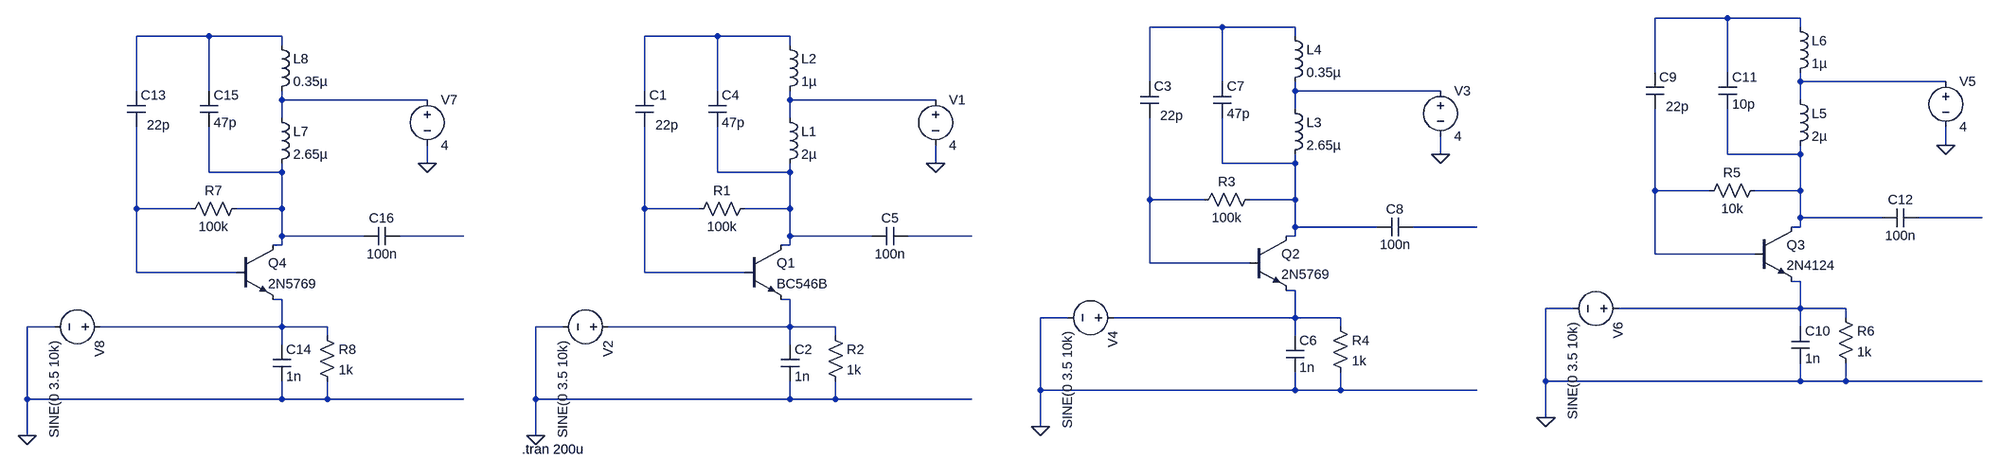
[diagram p0: schematic BJT_AM_Sender.asc]
BJT_AM_Sender.asc, the LTspice schematic file:
Version 4
SHEET 1 2468 680
WIRE 2016 -256 1888 -256
WIRE 2144 -256 2016 -256
WIRE 1120 -240 992 -240
WIRE 1248 -240 1120 -240
WIRE 2144 -240 2144 -256
WIRE -880 -224 -1008 -224
WIRE -752 -224 -880 -224
WIRE 48 -224 -80 -224
WIRE 176 -224 48 -224
WIRE 1248 -224 1248 -240
WIRE -752 -208 -752 -224
WIRE 176 -208 176 -224
WIRE 1888 -160 1888 -256
WIRE 2016 -160 2016 -256
WIRE 992 -144 992 -240
WIRE 1120 -144 1120 -240
WIRE 2144 -144 2144 -160
WIRE 2400 -144 2144 -144
WIRE -1008 -128 -1008 -224
WIRE -880 -128 -880 -224
WIRE -80 -128 -80 -224
WIRE 48 -128 48 -224
WIRE 1248 -128 1248 -144
WIRE 1504 -128 1248 -128
WIRE -752 -112 -752 -128
WIRE -496 -112 -752 -112
WIRE 176 -112 176 -128
WIRE 432 -112 176 -112
WIRE 2144 -112 2144 -144
WIRE 1248 -96 1248 -128
WIRE -752 -80 -752 -112
WIRE 176 -80 176 -112
WIRE 2400 -32 2400 -64
WIRE 1504 -16 1504 -48
WIRE 2016 -16 2016 -96
WIRE 2144 -16 2144 -32
WIRE 2144 -16 2016 -16
WIRE -496 0 -496 -32
WIRE 432 0 432 -32
WIRE 1120 0 1120 -80
WIRE 1248 0 1248 -16
WIRE 1248 0 1120 0
WIRE -880 16 -880 -64
WIRE -752 16 -752 0
WIRE -752 16 -880 16
WIRE 48 16 48 -64
WIRE 176 16 176 0
WIRE 176 16 48 16
WIRE 1888 48 1888 -96
WIRE 1984 48 1888 48
WIRE 2144 48 2144 -16
WIRE 2144 48 2064 48
WIRE 992 64 992 -80
WIRE 1088 64 992 64
WIRE 1248 64 1248 0
WIRE 1248 64 1168 64
WIRE -1008 80 -1008 -64
WIRE -912 80 -1008 80
WIRE -752 80 -752 16
WIRE -752 80 -832 80
WIRE -80 80 -80 -64
WIRE 16 80 -80 80
WIRE 176 80 176 16
WIRE 176 80 96 80
WIRE 2144 96 2144 48
WIRE 2288 96 2144 96
WIRE 2464 96 2352 96
WIRE 1248 112 1248 64
WIRE 1392 112 1248 112
WIRE 1568 112 1456 112
WIRE 2144 112 2144 96
WIRE 2144 112 2128 112
WIRE -752 128 -752 80
WIRE -608 128 -752 128
WIRE -432 128 -544 128
WIRE 176 128 176 80
WIRE 320 128 176 128
WIRE 496 128 384 128
WIRE 1248 128 1248 112
WIRE 1248 128 1232 128
WIRE -752 144 -752 128
WIRE -752 144 -768 144
WIRE 176 144 176 128
WIRE 176 144 160 144
WIRE 1888 160 1888 48
WIRE 2064 160 1888 160
WIRE 992 176 992 64
WIRE 1168 176 992 176
WIRE -1008 192 -1008 80
WIRE -832 192 -1008 192
WIRE -80 192 -80 80
WIRE 96 192 -80 192
WIRE 2144 208 2128 208
WIRE 1248 224 1232 224
WIRE -752 240 -768 240
WIRE 176 240 160 240
WIRE 1744 256 1696 256
WIRE 2144 256 2144 208
WIRE 2144 256 1824 256
WIRE 2224 256 2144 256
WIRE 848 272 800 272
WIRE 1248 272 1248 224
WIRE 1248 272 928 272
WIRE 1328 272 1248 272
WIRE 2224 272 2224 256
WIRE -1152 288 -1200 288
WIRE -752 288 -752 240
WIRE -752 288 -1072 288
WIRE -672 288 -752 288
WIRE -224 288 -272 288
WIRE 176 288 176 240
WIRE 176 288 -144 288
WIRE 256 288 176 288
WIRE 1328 288 1328 272
WIRE 2144 288 2144 256
WIRE -672 304 -672 288
WIRE 256 304 256 288
WIRE 1248 304 1248 272
WIRE -752 320 -752 288
WIRE 176 320 176 288
WIRE 1696 384 1696 256
WIRE 2144 384 2144 352
WIRE 2144 384 1696 384
WIRE 2224 384 2224 352
WIRE 2224 384 2144 384
WIRE 2464 384 2224 384
WIRE 800 400 800 272
WIRE 1248 400 1248 368
WIRE 1248 400 800 400
WIRE 1328 400 1328 368
WIRE 1328 400 1248 400
WIRE 1568 400 1328 400
WIRE -1200 416 -1200 288
WIRE -752 416 -752 384
WIRE -752 416 -1200 416
WIRE -672 416 -672 384
WIRE -672 416 -752 416
WIRE -432 416 -672 416
WIRE -272 416 -272 288
WIRE 176 416 176 384
WIRE 176 416 -272 416
WIRE 256 416 256 384
WIRE 256 416 176 416
WIRE 496 416 256 416
WIRE 1696 448 1696 384
WIRE 800 464 800 400
WIRE -1200 480 -1200 416
WIRE -272 480 -272 416
FLAG -272 480 0
FLAG 432 0 0
FLAG 800 464 0
FLAG 1504 -16 0
FLAG 1696 448 0
FLAG 2400 -32 0
FLAG -1200 480 0
FLAG -496 0 0
DATAFLAG -704 160 ""
SYMBOL res 112 64 R90
WINDOW 0 0 56 VBottom 2
WINDOW 3 32 56 VTop 2
SYMATTR InstName R1
SYMATTR Value 100k
SYMBOL res 240 288 R0
SYMATTR InstName R2
SYMATTR Value 1k
SYMBOL cap -96 -128 R0
WINDOW 3 35 60 Left 2
SYMATTR Value 22p
SYMATTR InstName C1
SYMBOL cap 160 320 R0
SYMATTR InstName C2
SYMATTR Value 1n
SYMBOL cap 32 -128 R0
SYMATTR InstName C4
SYMATTR Value 47p
SYMBOL cap 384 112 R90
WINDOW 0 0 32 VBottom 2
WINDOW 3 32 32 VTop 2
SYMATTR InstName C5
SYMATTR Value 100n
SYMBOL ind 160 -96 R0
SYMATTR InstName L1
SYMATTR Value 2µ
SYMBOL ind 160 -224 R0
SYMATTR InstName L2
SYMATTR Value 1µ
SYMBOL npn 96 144 R0
SYMATTR InstName Q1
SYMATTR Value BC546B
SYMBOL voltage 432 -128 R0
WINDOW 123 0 0 Left 2
WINDOW 39 0 0 Left 2
SYMATTR InstName V1
SYMATTR Value 4
SYMBOL voltage -128 288 R90
WINDOW 123 0 0 Left 2
WINDOW 39 0 0 Left 2
SYMATTR InstName V2
SYMATTR Value SINE(0 3.5 10k)
SYMBOL res 1184 48 R90
WINDOW 0 0 56 VBottom 2
WINDOW 3 32 56 VTop 2
SYMATTR InstName R3
SYMATTR Value 100k
SYMBOL res 1312 272 R0
SYMATTR InstName R4
SYMATTR Value 1k
SYMBOL cap 976 -144 R0
WINDOW 3 35 60 Left 2
SYMATTR Value 22p
SYMATTR InstName C3
SYMBOL cap 1232 304 R0
SYMATTR InstName C6
SYMATTR Value 1n
SYMBOL cap 1104 -144 R0
SYMATTR InstName C7
SYMATTR Value 47p
SYMBOL cap 1456 96 R90
WINDOW 0 0 32 VBottom 2
WINDOW 3 32 32 VTop 2
SYMATTR InstName C8
SYMATTR Value 100n
SYMBOL ind 1232 -112 R0
SYMATTR InstName L3
SYMATTR Value 2.65µ
SYMBOL ind 1232 -240 R0
SYMATTR InstName L4
SYMATTR Value 0.35µ
SYMBOL npn 1168 128 R0
SYMATTR InstName Q2
SYMATTR Value 2N5769
SYMBOL voltage 1504 -144 R0
WINDOW 123 0 0 Left 2
WINDOW 39 0 0 Left 2
SYMATTR InstName V3
SYMATTR Value 4
SYMBOL voltage 944 272 R90
WINDOW 123 0 0 Left 2
WINDOW 39 0 0 Left 2
SYMATTR InstName V4
SYMATTR Value SINE(0 3.5 10k)
SYMBOL res 2080 32 R90
WINDOW 0 0 56 VBottom 2
WINDOW 3 32 56 VTop 2
SYMATTR InstName R5
SYMATTR Value 10k
SYMBOL res 2208 256 R0
SYMATTR InstName R6
SYMATTR Value 1k
SYMBOL cap 1872 -160 R0
WINDOW 3 35 60 Left 2
SYMATTR Value 22p
SYMATTR InstName C9
SYMBOL cap 2128 288 R0
SYMATTR InstName C10
SYMATTR Value 1n
SYMBOL cap 2000 -160 R0
SYMATTR InstName C11
SYMATTR Value 10p
SYMBOL cap 2352 80 R90
WINDOW 0 0 32 VBottom 2
WINDOW 3 32 32 VTop 2
SYMATTR InstName C12
SYMATTR Value 100n
SYMBOL ind 2128 -128 R0
SYMATTR InstName L5
SYMATTR Value 2µ
SYMBOL ind 2128 -256 R0
SYMATTR InstName L6
SYMATTR Value 1µ
SYMBOL npn 2064 112 R0
SYMATTR InstName Q3
SYMATTR Value 2N4124
SYMBOL voltage 2400 -160 R0
WINDOW 123 0 0 Left 2
WINDOW 39 0 0 Left 2
SYMATTR InstName V5
SYMATTR Value 4
SYMBOL voltage 1840 256 R90
WINDOW 123 0 0 Left 2
WINDOW 39 0 0 Left 2
SYMATTR InstName V6
SYMATTR Value SINE(0 3.5 10k)
SYMBOL res -816 64 R90
WINDOW 0 0 56 VBottom 2
WINDOW 3 32 56 VTop 2
SYMATTR InstName R7
SYMATTR Value 100k
SYMBOL res -688 288 R0
SYMATTR InstName R8
SYMATTR Value 1k
SYMBOL cap -1024 -128 R0
WINDOW 3 35 60 Left 2
SYMATTR Value 22p
SYMATTR InstName C13
SYMBOL cap -768 320 R0
SYMATTR InstName C14
SYMATTR Value 1n
SYMBOL cap -896 -128 R0
SYMATTR InstName C15
SYMATTR Value 47p
SYMBOL cap -544 112 R90
WINDOW 0 0 32 VBottom 2
WINDOW 3 32 32 VTop 2
SYMATTR InstName C16
SYMATTR Value 100n
SYMBOL ind -768 -96 R0
SYMATTR InstName L7
SYMATTR Value 2.65µ
SYMBOL ind -768 -224 R0
SYMATTR InstName L8
SYMATTR Value 0.35µ
SYMBOL npn -832 144 R0
SYMATTR InstName Q4
SYMATTR Value 2N5769
SYMBOL voltage -496 -128 R0
WINDOW 123 0 0 Left 2
WINDOW 39 0 0 Left 2
SYMATTR InstName V7
SYMATTR Value 4
SYMBOL voltage -1056 288 R90
WINDOW 123 0 0 Left 2
WINDOW 39 0 0 Left 2
SYMATTR InstName V8
SYMATTR Value SINE(0 3.5 10k)
TEXT -296 504 Left 2 !.tran 200u

The netlist it stands for:
* BJT_AM_Sender.asc
R1 N012 N016 100k
R2 N024 0 1k
C1 N004 N016 22p
C2 N024 0 1n
C4 N004 N012 47p
C5 N020 N012 100n
L1 N008 N012 2µ
L2 N004 N008 1µ
Q1 N012 N016 N024 0 BC546B
V1 N008 0 4
V2 N024 0 SINE(0 3.5 10k)
R3 N010 N014 100k
R4 N022 0 1k
C3 N002 N014 22p
C6 N022 0 1n
C7 N002 N010 47p
C8 N018 N010 100n
L3 N006 N010 2.65µ
L4 N002 N006 0.35µ
Q2 N010 N014 N022 0 2N5769
V3 N006 0 4
V4 N022 0 SINE(0 3.5 10k)
R5 N009 N013 10k
R6 N021 0 1k
C9 N001 N013 22p
C10 N021 0 1n
C11 N001 N009 10p
C12 N017 N009 100n
L5 N005 N009 2µ
L6 N001 N005 1µ
Q3 N009 N013 N021 0 2N4124
V5 N005 0 4
V6 N021 0 SINE(0 3.5 10k)
R7 N011 N015 100k
R8 N023 0 1k
C13 N003 N015 22p
C14 N023 0 1n
C15 N003 N011 47p
C16 N019 N011 100n
L7 N007 N011 2.65µ
L8 N003 N007 0.35µ
Q4 N011 N015 N023 0 2N5769
V7 N007 0 4
V8 N023 0 SINE(0 3.5 10k)
.model NPN NPN
.model PNP PNP
.lib standard.bjt
.tran 200u
.backanno
.end